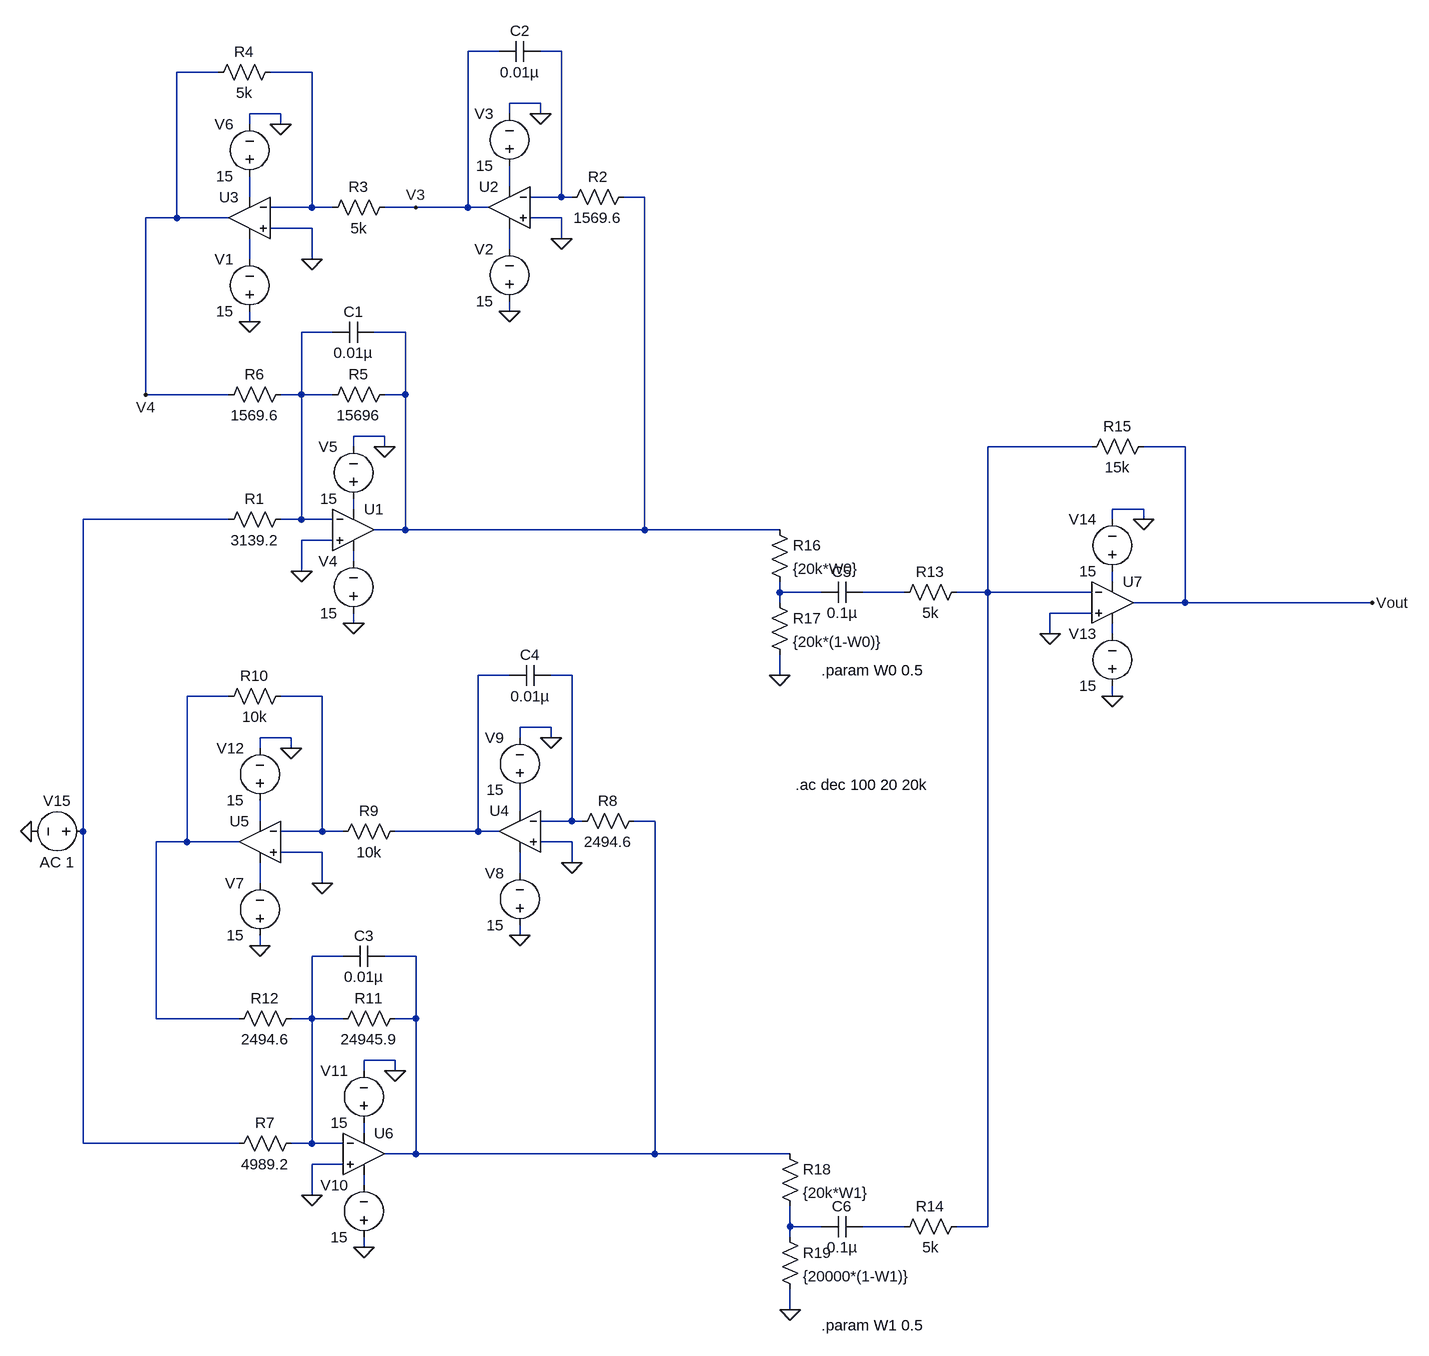
[diagram p0: schematic Full_Equalizer_Circuit_Poles.asc]
Full_Equalizer_Circuit_Poles.asc, the LTspice schematic file:
Version 4.1
SHEET 1 1608 1192
WIRE 192 -784 144 -784
WIRE 288 -784 256 -784
WIRE -240 -752 -304 -752
WIRE -96 -752 -160 -752
WIRE 256 -704 208 -704
WIRE -144 -688 -192 -688
WIRE 208 -688 208 -704
WIRE 256 -688 256 -704
WIRE -192 -672 -192 -688
WIRE -144 -672 -144 -688
WIRE 208 -576 208 -608
WIRE -192 -560 -192 -592
WIRE 288 -560 288 -784
WIRE 288 -560 240 -560
WIRE 304 -560 288 -560
WIRE 416 -560 384 -560
WIRE -96 -544 -96 -752
WIRE -96 -544 -160 -544
WIRE -64 -544 -96 -544
WIRE 64 -544 16 -544
WIRE 144 -544 144 -784
WIRE 144 -544 64 -544
WIRE 176 -544 144 -544
WIRE -304 -528 -304 -752
WIRE -304 -528 -352 -528
WIRE -224 -528 -304 -528
WIRE 288 -528 240 -528
WIRE -96 -512 -160 -512
WIRE 288 -496 288 -528
WIRE 208 -480 208 -512
WIRE -192 -464 -192 -496
WIRE -96 -464 -96 -512
WIRE 208 -384 208 -400
WIRE -192 -368 -192 -384
WIRE -64 -352 -112 -352
WIRE 48 -352 0 -352
WIRE -352 -256 -352 -528
WIRE -224 -256 -352 -256
WIRE -112 -256 -112 -352
WIRE -112 -256 -144 -256
WIRE -64 -256 -112 -256
WIRE 48 -256 48 -352
WIRE 48 -256 16 -256
WIRE 16 -192 -32 -192
WIRE -32 -176 -32 -192
WIRE 16 -176 16 -192
WIRE 1104 -176 944 -176
WIRE 1248 -176 1184 -176
WIRE -32 -80 -32 -96
WIRE 1184 -80 1136 -80
WIRE -224 -64 -448 -64
WIRE -112 -64 -112 -256
WIRE -112 -64 -144 -64
WIRE -64 -64 -112 -64
WIRE 1136 -64 1136 -80
WIRE 1184 -64 1184 -80
WIRE 48 -48 48 -256
WIRE 48 -48 0 -48
WIRE 416 -48 416 -560
WIRE 416 -48 48 -48
WIRE 624 -48 416 -48
WIRE -64 -32 -112 -32
WIRE -32 0 -32 -16
WIRE -112 16 -112 -32
WIRE 1136 32 1136 16
WIRE 624 48 624 32
WIRE 688 48 624 48
WIRE 816 48 752 48
WIRE 944 48 944 -176
WIRE 944 48 896 48
WIRE 1104 48 944 48
WIRE 624 64 624 48
WIRE 1248 64 1248 -176
WIRE 1248 64 1168 64
WIRE 1536 64 1248 64
WIRE 1104 80 1040 80
WIRE -32 96 -32 80
WIRE 1040 112 1040 80
WIRE 1136 112 1136 96
WIRE 208 176 160 176
WIRE 304 176 272 176
WIRE 624 176 624 144
WIRE -224 208 -288 208
WIRE -80 208 -144 208
WIRE 1136 208 1136 192
WIRE 272 256 224 256
WIRE -128 272 -176 272
WIRE 224 272 224 256
WIRE 272 272 272 256
WIRE -176 288 -176 272
WIRE -128 288 -128 272
WIRE 224 384 224 352
WIRE -176 400 -176 368
WIRE 304 400 304 176
WIRE 304 400 256 400
WIRE 320 400 304 400
WIRE 432 400 400 400
WIRE -448 416 -448 -64
WIRE -80 416 -80 208
WIRE -80 416 -144 416
WIRE -48 416 -80 416
WIRE 160 416 160 176
WIRE 160 416 32 416
WIRE 192 416 160 416
WIRE -288 432 -288 208
WIRE -288 432 -336 432
WIRE -208 432 -288 432
WIRE 304 432 256 432
WIRE -80 448 -144 448
WIRE 304 464 304 432
WIRE 224 480 224 448
WIRE -176 496 -176 464
WIRE -80 496 -80 448
WIRE 224 576 224 560
WIRE -176 592 -176 576
WIRE -48 608 -96 608
WIRE 64 608 16 608
WIRE -336 704 -336 432
WIRE -208 704 -336 704
WIRE -96 704 -96 608
WIRE -96 704 -128 704
WIRE -48 704 -96 704
WIRE 64 704 64 608
WIRE 64 704 32 704
WIRE 32 768 -16 768
WIRE -16 784 -16 768
WIRE 32 784 32 768
WIRE -16 880 -16 864
WIRE -448 896 -448 416
WIRE -208 896 -448 896
WIRE -96 896 -96 704
WIRE -96 896 -128 896
WIRE -48 896 -96 896
WIRE 64 912 64 704
WIRE 64 912 16 912
WIRE 432 912 432 400
WIRE 432 912 64 912
WIRE 640 912 432 912
WIRE -48 928 -96 928
WIRE -16 960 -16 944
WIRE -96 976 -96 928
WIRE 640 1024 640 992
WIRE 688 1024 640 1024
WIRE 816 1024 752 1024
WIRE 944 1024 944 48
WIRE 944 1024 896 1024
WIRE 640 1040 640 1024
WIRE -16 1056 -16 1040
WIRE 640 1152 640 1120
FLAG -112 16 0
FLAG -96 -464 0
FLAG 64 -544 V3
FLAG -192 -368 0
FLAG 256 -688 0
FLAG 208 -384 0
FLAG 16 -176 0
FLAG -32 96 0
FLAG -352 -256 V4
FLAG 288 -496 0
FLAG -144 -672 0
FLAG -96 976 0
FLAG -80 496 0
FLAG -176 592 0
FLAG 272 272 0
FLAG 224 576 0
FLAG 32 784 0
FLAG -16 1056 0
FLAG 304 464 0
FLAG -128 288 0
FLAG 1184 -64 0
FLAG 1136 208 0
FLAG 1040 112 0
FLAG 1536 64 Vout
FLAG 624 176 0
FLAG 640 1152 0
FLAG -528 416 0
SYMBOL res -128 -80 R90
WINDOW 0 0 56 VBottom 2
WINDOW 3 32 56 VTop 2
SYMATTR InstName R1
SYMATTR Value 3139.2
SYMBOL res 400 -576 R90
WINDOW 0 0 56 VBottom 2
WINDOW 3 32 56 VTop 2
SYMATTR InstName R2
SYMATTR Value 1569.6
SYMBOL res 32 -560 R90
WINDOW 0 0 56 VBottom 2
WINDOW 3 32 56 VTop 2
SYMATTR InstName R3
SYMATTR Value 5k
SYMBOL voltage -192 -368 R180
WINDOW 0 24 96 Left 2
WINDOW 3 24 16 Left 2
SYMATTR InstName V1
SYMATTR Value 15
SYMBOL res -144 -768 R90
WINDOW 0 0 56 VBottom 2
WINDOW 3 32 56 VTop 2
SYMATTR InstName R4
SYMATTR Value 5k
SYMBOL voltage 208 -384 R180
WINDOW 0 24 96 Left 2
WINDOW 3 24 16 Left 2
SYMATTR InstName V2
SYMATTR Value 15
SYMBOL voltage 208 -592 R180
WINDOW 0 24 96 Left 2
WINDOW 3 24 16 Left 2
SYMATTR InstName V3
SYMATTR Value 15
SYMBOL voltage -32 96 R180
WINDOW 0 24 96 Left 2
WINDOW 3 24 16 Left 2
SYMATTR InstName V4
SYMATTR Value 15
SYMBOL voltage -32 -80 R180
WINDOW 0 24 96 Left 2
WINDOW 3 24 16 Left 2
SYMATTR InstName V5
SYMATTR Value 15
SYMBOL res 32 -272 R90
WINDOW 0 0 56 VBottom 2
WINDOW 3 32 56 VTop 2
SYMATTR InstName R5
SYMATTR Value 15696
SYMBOL cap 0 -368 R90
WINDOW 0 0 32 VBottom 2
WINDOW 3 32 32 VTop 2
SYMATTR InstName C1
SYMATTR Value 0.01µ
SYMBOL cap 256 -800 R90
WINDOW 0 0 32 VBottom 2
WINDOW 3 32 32 VTop 2
SYMATTR InstName C2
SYMATTR Value 0.01µ
SYMBOL res -128 -272 R90
WINDOW 0 0 56 VBottom 2
WINDOW 3 32 56 VTop 2
SYMATTR InstName R6
SYMATTR Value 1569.6
SYMBOL voltage -192 -576 R180
WINDOW 0 24 96 Left 2
WINDOW 3 24 16 Left 2
SYMATTR InstName V6
SYMATTR Value 15
SYMBOL res -112 880 R90
WINDOW 0 0 56 VBottom 2
WINDOW 3 32 56 VTop 2
SYMATTR InstName R7
SYMATTR Value 4989.2
SYMBOL res 416 384 R90
WINDOW 0 0 56 VBottom 2
WINDOW 3 32 56 VTop 2
SYMATTR InstName R8
SYMATTR Value 2494.6
SYMBOL res 48 400 R90
WINDOW 0 0 56 VBottom 2
WINDOW 3 32 56 VTop 2
SYMATTR InstName R9
SYMATTR Value 10k
SYMBOL voltage -176 592 R180
WINDOW 0 24 96 Left 2
WINDOW 3 24 16 Left 2
SYMATTR InstName V7
SYMATTR Value 15
SYMBOL res -128 192 R90
WINDOW 0 0 56 VBottom 2
WINDOW 3 32 56 VTop 2
SYMATTR InstName R10
SYMATTR Value 10k
SYMBOL voltage 224 576 R180
WINDOW 0 24 96 Left 2
WINDOW 3 24 16 Left 2
SYMATTR InstName V8
SYMATTR Value 15
SYMBOL voltage 224 368 R180
WINDOW 0 24 96 Left 2
WINDOW 3 24 16 Left 2
SYMATTR InstName V9
SYMATTR Value 15
SYMBOL voltage -16 1056 R180
WINDOW 0 24 96 Left 2
WINDOW 3 24 16 Left 2
SYMATTR InstName V10
SYMATTR Value 15
SYMBOL voltage -16 880 R180
WINDOW 0 24 96 Left 2
WINDOW 3 24 16 Left 2
SYMATTR InstName V11
SYMATTR Value 15
SYMBOL res 48 688 R90
WINDOW 0 0 56 VBottom 2
WINDOW 3 32 56 VTop 2
SYMATTR InstName R11
SYMATTR Value 24945.9
SYMBOL cap 16 592 R90
WINDOW 0 0 32 VBottom 2
WINDOW 3 32 32 VTop 2
SYMATTR InstName C3
SYMATTR Value 0.01µ
SYMBOL cap 272 160 R90
WINDOW 0 0 32 VBottom 2
WINDOW 3 32 32 VTop 2
SYMATTR InstName C4
SYMATTR Value 0.01µ
SYMBOL res -112 688 R90
WINDOW 0 0 56 VBottom 2
WINDOW 3 32 56 VTop 2
SYMATTR InstName R12
SYMATTR Value 2494.6
SYMBOL voltage -176 384 R180
WINDOW 0 24 96 Left 2
WINDOW 3 24 16 Left 2
SYMATTR InstName V12
SYMATTR Value 15
SYMBOL cap 752 32 R90
WINDOW 0 0 32 VBottom 2
WINDOW 3 32 32 VTop 2
SYMATTR InstName C5
SYMATTR Value 0.1µ
SYMBOL cap 752 1008 R90
WINDOW 0 0 32 VBottom 2
WINDOW 3 32 32 VTop 2
SYMATTR InstName C6
SYMATTR Value 0.1µ
SYMBOL res 912 32 R90
WINDOW 0 0 56 VBottom 2
WINDOW 3 32 56 VTop 2
SYMATTR InstName R13
SYMATTR Value 5k
SYMBOL res 912 1008 R90
WINDOW 0 0 56 VBottom 2
WINDOW 3 32 56 VTop 2
SYMATTR InstName R14
SYMATTR Value 5k
SYMBOL voltage 1136 208 R180
WINDOW 0 24 96 Left 2
WINDOW 3 24 16 Left 2
SYMATTR InstName V13
SYMATTR Value 15
SYMBOL voltage 1136 32 R180
WINDOW 0 24 96 Left 2
WINDOW 3 24 16 Left 2
SYMATTR InstName V14
SYMATTR Value 15
SYMBOL res 1200 -192 R90
WINDOW 0 0 56 VBottom 2
WINDOW 3 32 56 VTop 2
SYMATTR InstName R15
SYMATTR Value 15k
SYMBOL res 608 -64 R0
SYMATTR InstName R16
SYMATTR Value {20k*W0}
SYMBOL res 608 48 R0
SYMATTR InstName R17
SYMATTR Value {20k*(1-W0)}
SYMBOL res 624 896 R0
SYMATTR InstName R18
SYMATTR Value {20k*W1}
SYMBOL res 624 1024 R0
SYMATTR InstName R19
SYMATTR Value {20000*(1-W1)}
SYMBOL OpAmps\\UniversalOpAmp2 -32 -48 R0
SYMATTR InstName U1
SYMBOL OpAmps\\UniversalOpAmp2 208 -544 M0
SYMATTR InstName U2
SYMBOL OpAmps\\UniversalOpAmp2 -192 -528 M0
SYMATTR InstName U3
SYMBOL OpAmps\\UniversalOpAmp2 224 416 M0
SYMATTR InstName U4
SYMBOL OpAmps\\UniversalOpAmp2 -176 432 M0
SYMATTR InstName U5
SYMBOL OpAmps\\UniversalOpAmp2 -16 912 R0
SYMATTR InstName U6
SYMBOL OpAmps\\UniversalOpAmp2 1136 64 R0
SYMATTR InstName U7
SYMBOL voltage -432 416 R90
WINDOW 0 -32 56 VBottom 2
WINDOW 3 32 56 VTop 2
SYMATTR InstName V15
SYMATTR Value AC 1
TEXT 688 168 Left 2 !.param W0 0.5
TEXT 688 1176 Left 2 !.param W1 0.5
TEXT 648 344 Left 2 !.ac dec 100 20 20k

The netlist it stands for:
* Full_Equalizer_Circuit_Poles.asc
R1 N008 N011 3139.2
R2 N005 N001 1569.6
R3 V3 N002 5k
V1 0 N007 15
R4 N002 V4 5k
V2 0 N006 15
V3 N003 0 15
V4 0 N012 15
V5 N010 0 15
R5 N005 N008 15696
C1 N005 N008 0.01µ
C2 N001 V3 0.01µ
R6 N008 V4 1569.6
V6 N004 0 15
R7 N026 N011 4989.2
R8 N023 N018 2494.6
R9 N017 N020 10k
V7 0 N025 15
R10 N020 N019 10k
V8 0 N024 15
V9 N021 0 15
V10 0 N028 15
V11 N027 0 15
R11 N023 N026 24945.9
C3 N023 N026 0.01µ
C4 N018 N017 0.01µ
R12 N026 N019 2494.6
V12 N022 0 15
C5 N015 N014 0.1µ
C6 N030 N029 0.1µ
R13 N009 N015 5k
R14 N009 N030 5k
V13 0 N016 15
V14 N013 0 15
R15 Vout N009 15k
R16 N005 N014 {20k*W0}
R17 N014 0 {20k*(1-W0)}
R18 N023 N029 {20k*W1}
R19 N029 0 {20000*(1-W1)}
X§U1 0 N008 N010 N012 N005 level2 Avol=1Meg GBW=10Meg Slew=10Meg Ilimit=25m Rail=0 Vos=0 En=0 Enk=0 In=0 Ink=0 Rin=500Meg  ; pins In+ In- V+ V- OUT
X§U2 0 N001 N003 N006 V3 level2 Avol=1Meg GBW=10Meg Slew=10Meg Ilimit=25m Rail=0 Vos=0 En=0 Enk=0 In=0 Ink=0 Rin=500Meg  ; pins In+ In- V+ V- OUT
X§U3 0 N002 N004 N007 V4 level2 Avol=1Meg GBW=10Meg Slew=10Meg Ilimit=25m Rail=0 Vos=0 En=0 Enk=0 In=0 Ink=0 Rin=500Meg  ; pins In+ In- V+ V- OUT
X§U4 0 N018 N021 N024 N017 level2 Avol=1Meg GBW=10Meg Slew=10Meg Ilimit=25m Rail=0 Vos=0 En=0 Enk=0 In=0 Ink=0 Rin=500Meg  ; pins In+ In- V+ V- OUT
X§U5 0 N020 N022 N025 N019 level2 Avol=1Meg GBW=10Meg Slew=10Meg Ilimit=25m Rail=0 Vos=0 En=0 Enk=0 In=0 Ink=0 Rin=500Meg  ; pins In+ In- V+ V- OUT
X§U6 0 N026 N027 N028 N023 level2 Avol=1Meg GBW=10Meg Slew=10Meg Ilimit=25m Rail=0 Vos=0 En=0 Enk=0 In=0 Ink=0 Rin=500Meg  ; pins In+ In- V+ V- OUT
X§U7 0 N009 N013 N016 Vout level2 Avol=1Meg GBW=10Meg Slew=10Meg Ilimit=25m Rail=0 Vos=0 En=0 Enk=0 In=0 Ink=0 Rin=500Meg  ; pins In+ In- V+ V- OUT
V15 N011 0 AC 1
.param W0 0.5
.param W1 0.5
.ac dec 100 20 20k
.lib UniversalOpAmp2.lib
.backanno
.end